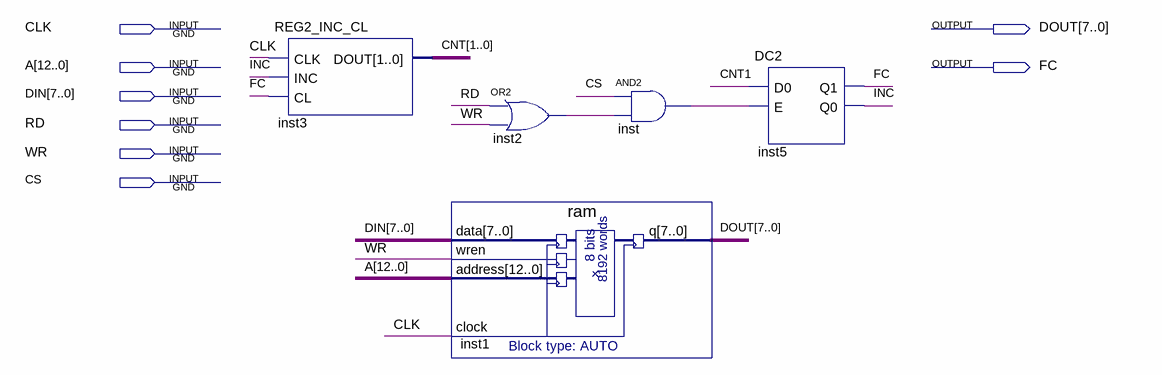
[diagram p0: schematic sheet]
// Quartus schematic ram_controller.bdf as structural Verilog: 5 symbols, 8 pins
module ram_controller (
  input  CLK,
  input  [12:0] A,
  input  [7:0] DIN,
  input  RD,
  input  WR,
  input  CS,
  output [7:0] DOUT,
  output FC
);

  wire INC, inst2_out, inst_out;
  wire [1:0] CNT;

  REG2_INC_CL inst3 (.CLK(CLK), .INC(INC), .CL(FC), .DOUT(CNT));
  ram inst1 (.data(DIN), .wren(WR), .address(A), .clock(CLK), .q(DOUT));
  or inst2 (inst2_out, RD, WR);
  and inst (inst_out, CS, inst2_out);
  DC2 inst5 (.D0(CNT[1]), .E(inst_out), .Q1(FC), .Q0(INC));
endmodule
